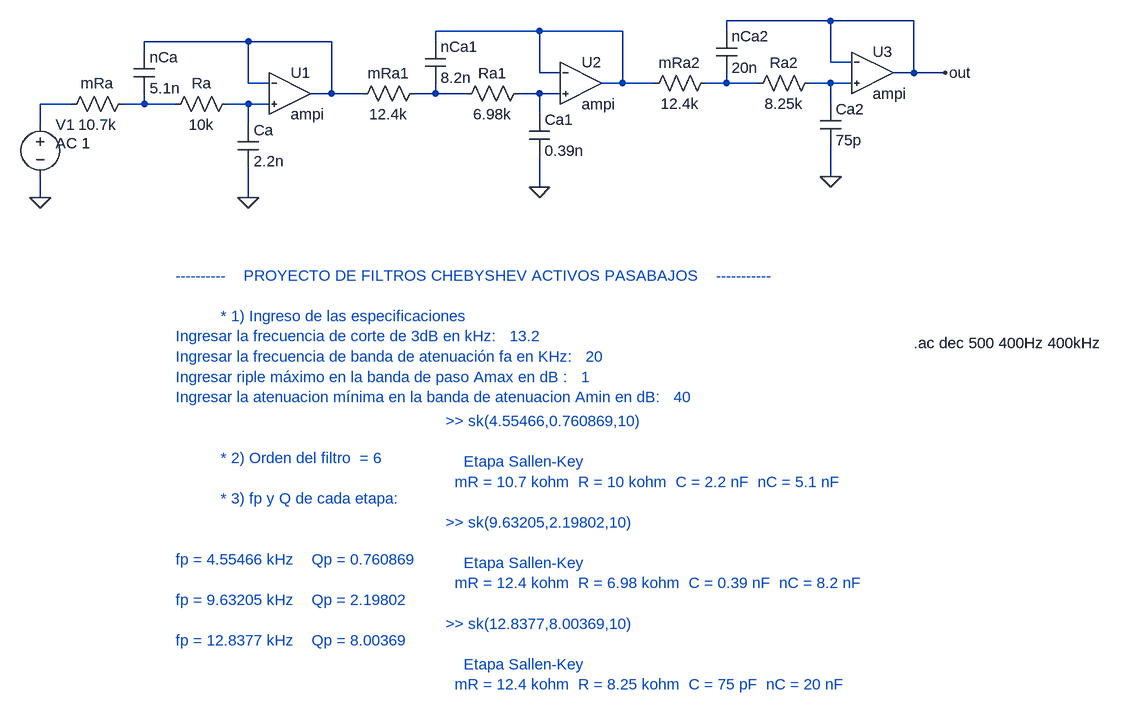
[diagram p0: schematic filtro_problema10_tp7.asc]
filtro_problema10_tp7.asc, the LTspice schematic file:
Version 4
SHEET 1 1240 680
WIRE 800 -368 640 -368
WIRE 928 -368 800 -368
WIRE 352 -352 192 -352
WIRE 480 -352 352 -352
WIRE 640 -352 640 -368
WIRE -96 -336 -256 -336
WIRE 32 -336 -96 -336
WIRE 192 -336 192 -352
WIRE -256 -320 -256 -336
WIRE 800 -304 800 -368
WIRE 832 -304 800 -304
WIRE 352 -288 352 -352
WIRE 384 -288 352 -288
WIRE 928 -288 928 -368
WIRE 928 -288 896 -288
WIRE 976 -288 928 -288
WIRE -96 -272 -96 -336
WIRE -64 -272 -96 -272
WIRE 480 -272 480 -352
WIRE 480 -272 448 -272
WIRE 528 -272 480 -272
WIRE 640 -272 640 -288
WIRE 640 -272 608 -272
WIRE 688 -272 640 -272
WIRE 800 -272 768 -272
WIRE 832 -272 800 -272
WIRE 32 -256 32 -336
WIRE 32 -256 0 -256
WIRE 80 -256 32 -256
WIRE 192 -256 192 -272
WIRE 192 -256 160 -256
WIRE 240 -256 192 -256
WIRE 352 -256 320 -256
WIRE 384 -256 352 -256
WIRE -368 -240 -416 -240
WIRE -256 -240 -256 -256
WIRE -256 -240 -288 -240
WIRE -208 -240 -256 -240
WIRE -96 -240 -128 -240
WIRE -64 -240 -96 -240
WIRE 800 -240 800 -272
WIRE 352 -224 352 -256
WIRE -416 -208 -416 -240
WIRE -96 -208 -96 -240
WIRE 800 -128 800 -176
WIRE 352 -112 352 -160
WIRE -416 -96 -416 -128
WIRE -96 -96 -96 -144
FLAG -96 -96 0
FLAG -416 -96 0
FLAG 352 -112 0
FLAG 800 -128 0
FLAG 976 -288 out
SYMBOL Circuitos2\\ComponentesIdeales\\ampi -32 -320 R0
SYMATTR InstName U1
SYMBOL cap -272 -320 R0
SYMATTR InstName nCa
SYMATTR Value 5.1n
SYMBOL res -112 -256 R90
WINDOW 0 0 56 VBottom 2
WINDOW 3 32 56 VTop 2
SYMATTR InstName Ra
SYMATTR Value 10k
SYMBOL cap -112 -208 R0
SYMATTR InstName Ca
SYMATTR Value 2.2n
SYMBOL res -272 -256 R90
WINDOW 0 0 56 VBottom 2
WINDOW 3 32 56 VTop 2
SYMATTR InstName mRa
SYMATTR Value 10.7k
SYMBOL voltage -416 -224 R0
WINDOW 123 24 44 Left 2
WINDOW 39 0 0 Left 0
SYMATTR InstName V1
SYMATTR Value ""
SYMATTR Value2 AC 1
SYMBOL Circuitos2\\ComponentesIdeales\\ampi 416 -336 R0
SYMATTR InstName U2
SYMBOL cap 176 -336 R0
SYMATTR InstName nCa1
SYMATTR Value 8.2n
SYMBOL res 336 -272 R90
WINDOW 0 0 56 VBottom 2
WINDOW 3 32 56 VTop 2
SYMATTR InstName Ra1
SYMATTR Value 6.98k
SYMBOL cap 336 -224 R0
SYMATTR InstName Ca1
SYMATTR Value 0.39n
SYMBOL res 176 -272 R90
WINDOW 0 0 56 VBottom 2
WINDOW 3 32 56 VTop 2
SYMATTR InstName mRa1
SYMATTR Value 12.4k
SYMBOL Circuitos2\\ComponentesIdeales\\ampi 864 -352 R0
SYMATTR InstName U3
SYMBOL cap 624 -352 R0
SYMATTR InstName nCa2
SYMATTR Value 20n
SYMBOL res 784 -288 R90
WINDOW 0 0 56 VBottom 2
WINDOW 3 32 56 VTop 2
SYMATTR InstName Ra2
SYMATTR Value 8.25k
SYMBOL cap 784 -240 R0
SYMATTR InstName Ca2
SYMATTR Value 75p
SYMBOL res 624 -288 R90
WINDOW 0 0 56 VBottom 2
WINDOW 3 32 56 VTop 2
SYMATTR InstName mRa2
SYMATTR Value 12.4k
TEXT -208 24 Left 2 ;----------    PROYECTO DE FILTROS CHEBYSHEV ACTIVOS PASABAJOS    -----------\n \n          * 1) Ingreso de las especificaciones   \nIngresar la frecuencia de corte de 3dB en kHz:   13.2\nIngresar la frecuencia de banda de atenuación fa en KHz:   20\nIngresar riple máximo en la banda de paso Amax en dB :   1\nIngresar la atenuacion mínima en la banda de atenuacion Amin en dB:   40\n \n \n          * 2) Orden del filtro  = 6  \n \n          * 3) fp y Q de cada etapa: \n \n \nfp = 4.55466 kHz    Qp = 0.760869  \n \nfp = 9.63205 kHz    Qp = 2.19802  \n \nfp = 12.8377 kHz    Qp = 8.00369
TEXT 208 248 Left 2 ;>> sk(4.55466,0.760869,10)\n \n    Etapa Sallen-Key\n  mR = 10.7 kohm  R = 10 kohm  C = 2.2 nF  nC = 5.1 nF\n \n>> sk(9.63205,2.19802,10)\n \n    Etapa Sallen-Key\n  mR = 12.4 kohm  R = 6.98 kohm  C = 0.39 nF  nC = 8.2 nF\n \n>> sk(12.8377,8.00369,10)\n \n    Etapa Sallen-Key\n  mR = 12.4 kohm  R = 8.25 kohm  C = 75 pF  nC = 20 nF
TEXT 928 128 Left 2 !.ac dec 500 400Hz 400kHz

The netlist it stands for:
* filtro_problema10_tp7.asc
XU1 N009 N002 N002 ampi Ren=1e9, Rsal=1, A=1e9  ; pins p n s
C§nCa N002 N008 5.1n
Ra N009 N008 10k
Ca N009 0 2.2n
R§mRa N008 N007 10.7k
V1 N007 0 AC 1
XU2 N006 N001 N001 ampi Ren=1e9, Rsal=1, A=1e9  ; pins p n s
C§nCa1 N001 N005 8.2n
Ra1 N006 N005 6.98k
Ca1 N006 0 0.39n
R§mRa1 N005 N002 12.4k
XU3 N004 out out ampi Ren=1e9, Rsal=1, A=1e9  ; pins p n s
C§nCa2 out N003 20n
Ra2 N004 N003 8.25k
Ca2 N004 0 75p
R§mRa2 N003 N001 12.4k
* ----------    PROYECTO DE FILTROS CHEBYSHEV ACTIVOS PASABAJOS    -----------
*           * 1) Ingreso de las especificaciones
* Ingresar la frecuencia de corte de 3dB en kHz:   13.2
* Ingresar la frecuencia de banda de atenuación fa en KHz:   20
* Ingresar riple máximo en la banda de paso Amax en dB :   1
* Ingresar la atenuacion mínima en la banda de atenuacion Amin en dB:   40
*           * 2) Orden del filtro  = 6
*           * 3) fp y Q de cada etapa:
* fp = 4.55466 kHz    Qp = 0.760869
* fp = 9.63205 kHz    Qp = 2.19802
* fp = 12.8377 kHz    Qp = 8.00369
* >> sk(4.55466,0.760869,10)
*     Etapa Sallen-Key
*   mR = 10.7 kohm  R = 10 kohm  C = 2.2 nF  nC = 5.1 nF
* >> sk(9.63205,2.19802,10)
*     Etapa Sallen-Key
*   mR = 12.4 kohm  R = 6.98 kohm  C = 0.39 nF  nC = 8.2 nF
* >> sk(12.8377,8.00369,10)
*     Etapa Sallen-Key
*   mR = 12.4 kohm  R = 8.25 kohm  C = 75 pF  nC = 20 nF
.ac dec 500 400Hz 400kHz
.lib ..\sym\Circuitos2\ComponentesIdeales\compoideales.lib
.backanno
.end